# EasyEDA Pro project banzang电容_2023-06-19.epro, board POWER
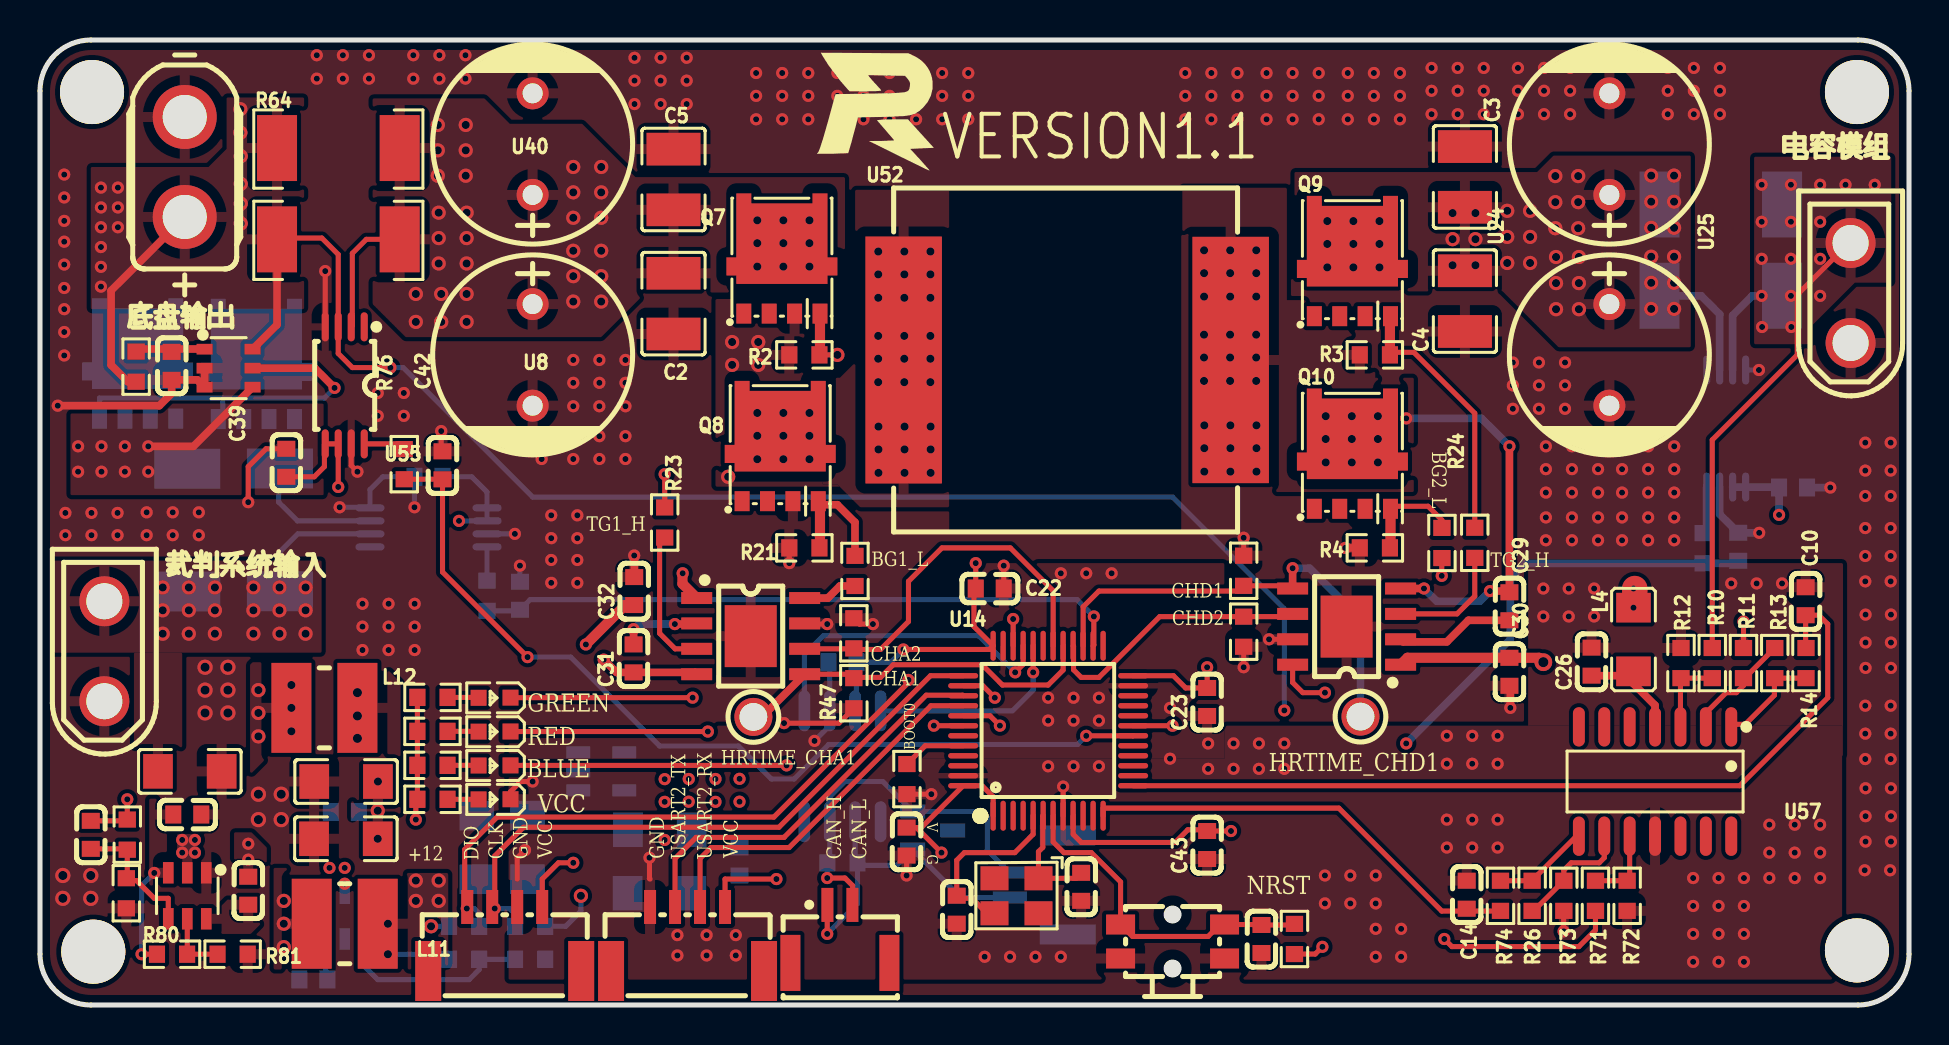
[diagram p2: board, top side]
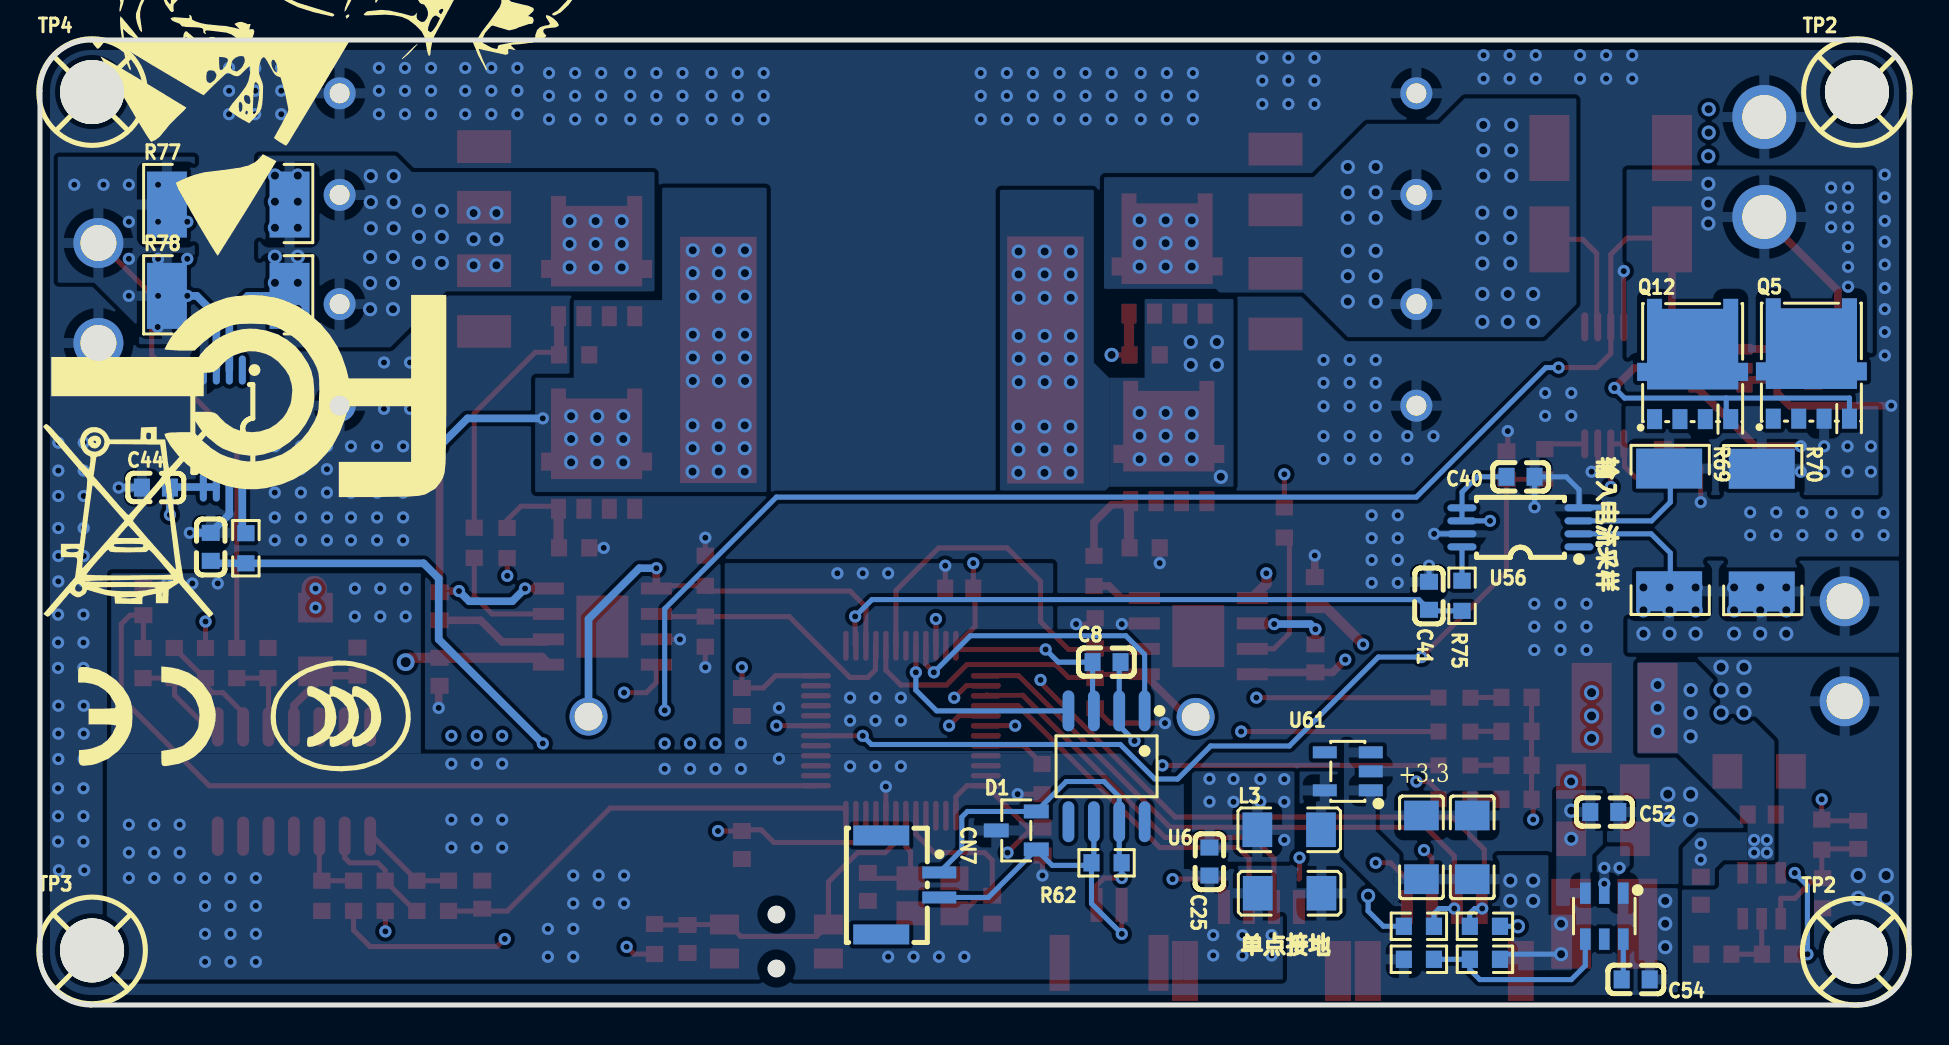
[diagram p3: board, bottom side, seen from below]

Outline 93.47 x 48.26 mm; copper layers: Top Layer, GND, VCC, Bottom Layer. Coordinates in mm from the lower left corner of the outline.
Outline path: 0,45.72 0,2.54 arc(0.74,0.74) 2.54,0 90.93,0 arc(92.73,0.74) 93.47,2.54 93.47,45.72 arc(92.73,47.52) 90.93,48.26 2.54,48.26 arc(0.74,47.52) 0,45.72
Stack: Top Layer 0.035mm / Dielectric1 0.48mm PP er 4.5 / GND 0.035mm / Dielectric2 0.48mm FR4 er 4.5 / VCC 0.035mm / Dielectric3 0.48mm PP er 4.5 / Bottom Layer 0.035mm

## Design rules (mm)
template: 自定义配置
spacing copperThickness1oz (default): track to track 0.102, other pairs 0.102 to 0.3
spacing copperThickness2oz: track to track 0.203, other pairs 0.152 to 0.3
track width copperThickness1oz (default): min 0.127, default 0.254, max 2.54
track width copperThickness2oz: min 0.203, default 0.254, max 2.54
differential pair differentialPair (default): width min 0.127, default 0.254, max 2.54; gap min 0.152, default 0.152
via viaSize (default): diameter min 0.5, default 0.61, max 10; hole min 0.3, default 0.305, max 6.299

## Placement (name value [footprint] x y rotation side)
C1  104/0603  [C0603]  6.59 31.96 270 top
C2  100uF  [C1210]  31.68 35.07 90 top
C3  100uF  [C1210]  71.26 41.41 270 top
C4  100uF  [C1210]  71.26 35.2 90 top
C5  100uF  [C1210]  31.68 41.28 270 top
C8  4.7uf  [C0603]  40.13 17.14 180 bottom
C10  10nf  [C0603]  88.3 20.19 90 top
C14  100nF  [C0603]  71.35 5.52 270 top
C18  100nF  [C0603]  61.09 3.3 90 top
C19  22pf  [C0603]  45.85 4.77 270 top
C20  22pf  [C0603]  52.07 5.91 270 top
C22  0.1uf  [C0603]  47.5 20.83 180 top
C23  0.1uf  [C0603]  58.37 15.16 90 top
C24  0.1uf  [C0603]  43.34 8.17 90 top
C25  0.1uf  [C0603]  34.99 7.17 90 bottom
C26  100nF  [C0603]  77.6 17.17 90 top
C29  104  [C0603]  73.49 19.94 270 top
C30  104  [C0603]  73.49 16.66 270 top
C31  104  [C0603]  29.69 17.33 90 top
C32  104  [C0603]  29.72 20.7 90 top
C39  100nF  [C0603]  12.32 27.12 270 top
C40  100nF  [C0603]  19.43 26.42 0 bottom
C41  10nf  [C0603]  24.01 20.47 90 bottom
C42  10nf  [C0603]  20.13 26.99 90 top
C43  0.1uf  [C0603]  58.37 8 90 top
C44  100nF  [C0603]  87.67 25.88 180 bottom
C45  10nf  [C0603]  84.93 22.91 90 bottom
C46  100nf  [C0603]  7.37 9.53 180 top
C47  10uF  [C1206]  7.49 11.68 180 top
C48  100nF  [C0603]  10.41 5.72 270 top
C49  10uF  [C1206]  15.31 11.18 180 top
C50  10uF  [C1206]  15.3 8.31 180 top
C51  NC  [C0603]  2.54 8.51 270 top
C52  100nf  [C0603]  15.24 9.65 0 bottom
C54  100nF  [C0603]  13.67 1.28 0 bottom
C55  10uF  [C1206]  24.38 7.88 90 bottom
C56  10uF  [C1206]  21.84 7.88 90 bottom
CN1  WAFER-GH1.25-2PWB  [CONN-TH_2P-P1.25_XUNPU_WAFER-GH1.25-2PWB]  40.01 3.56 0 top
CN2  A1257WR-S-4P  [CONN-SMD_A1257WR-S-4P]  32.39 3.3 0 top
CN3  A1257WR-S-4P  [CONN-SMD_A1257WR-S-4P]  23.24 3.3 0 top
CN4  XT30UPB-M  [CONN-TH_XT30UPB-M]  3.22 17.69 90 top
CN5  XT30UPB-F30.G.Y  [CONN-TH_XT30UPB-F]  7.24 41.91 90 top
CN6  XT30UPB-M  [CONN-TH_XT30UPB-M]  90.55 35.61 90 top
CN7  WAFER-GH1.25-2PWB  [CONN-TH_2P-P1.25_XUNPU_WAFER-GH1.25-2PWB]  49.95 6 270 bottom
D1  NUP2105L  [SOT-23-3_L2.9-W1.3-P1.90-LS2.4-BR]  44.65 8.73 180 bottom
L3  BLM31PG601SN1L  [L1206]  31 8.76 180 bottom
L4  10uH  [L1206]  79.69 18.28 90 top
L7  BLM31PG601SN1L  [L1206]  30.98 5.59 0 bottom
L11  22uH  [IND-SMD_L4.5-W4.0_CD43]  15.24 4.06 180 top
L12  22uH  [IND-SMD_L4.5-W4.0_CD43]  14.22 14.86 180 top
LED1  19-217/GHC-YR1S2/3T  [LED0603-RD]  22.73 10.29 180 top
LED2  19-217/GHC-YR1S2/3T  [LED0603-RD]  22.73 11.98 180 top
LED3  19-217/GHC-YR1S2/3T  [LED0603-RD]  22.73 13.67 180 top
LED4  19-217/GHC-YR1S2/3T  [LED0603-RD]  22.73 15.37 180 top
Q5  NMOS  [nmos qfn封装]  4.88 32.68 180 bottom
Q7  NMOS  [nmos qfn封装]  37.1 37.93 0 top
Q8  NMOS  [nmos qfn封装]  37.02 28.56 0 top
Q9  NMOS  [nmos qfn封装]  65.64 37.81 0 top
Q10  NMOS  [nmos qfn封装]  65.64 28.17 0 top
Q12  NMOS  [nmos qfn封装]  10.82 32.66 180 bottom
R1  47R/0603  [R0603]  4.81 31.92 90 top
R2  10K  [R0603]  38.23 32.51 0 top
R3  10K  [R0603]  66.76 32.51 0 top
R4  10K  [R0603]  66.76 22.86 0 top
R10  15K  [R0603]  83.63 17.1 270 top
R11  15K  [R0603]  85.19 17.1 270 top
R12  1K  [R0603]  82.07 17.1 270 top
R13  1K  [R0603]  86.76 17.1 270 top
R14  1K  [R0603]  88.32 17.1 90 top
R21  10K  [R0603]  38.23 22.86 0 top
R22  10Ω  [R0603]  40.76 21.71 270 top
R23  10Ω  [R0603]  31.24 24.13 270 top
R24  10Ω  [R0603]  71.76 23.11 90 top
R25  10Ω  [R0603]  70.11 23.11 90 top
R26  1K  [R0603]  74.62 5.46 90 top
R32  10K  [R0603]  62.74 3.3 270 top
R33  10K  [R0603]  43.36 11.3 90 top
R34  10K  [R0603]  19.63 10.29 0 top
R35  10K  [R0603]  19.63 11.99 0 top
R36  10K  [R0603]  19.63 13.69 0 top
R37  10K  [R0603]  19.63 15.38 0 top
R40  4.7K  [R0603]  24.51 3.94 0 bottom
R41  4.7K  [R0603]  21.21 3.94 180 bottom
R44  10K  [R0603]  60.2 21.72 270 top
R45  10K  [R0603]  60.2 18.67 90 top
R46  10K  [R0603]  40.7 18.59 270 top
R47  10K  [R0603]  40.7 15.59 90 top
R62  120Ω  [R0603]  40.13 7.11 180 bottom
R63  20mΩ  [RES-SMD_L6.4-W3.2-R2512]  14.92 38.29 180 top
R64  20mΩ  [RES-SMD_L6.4-W3.2-R2512]  14.92 42.86 180 top
R69  10mΩ  [RES-SMD_L6.4-W3.2-R2512]  12 23.76 270 bottom
R70  10mΩ  [RES-SMD_L6.4-W3.2-R2512]  7.37 23.75 270 bottom
R71  15K  [R0603]  77.79 5.46 90 top
R72  1K  [R0603]  79.38 5.46 90 top
R73  15K  [R0603]  76.21 5.46 90 top
R74  1K  [R0603]  73.04 5.46 270 top
R75  1K  [R0603]  22.36 20.47 270 bottom
R76  1K  [R0603]  18.22 27.05 270 top
R77  20mΩ  [RES-SMD_L6.4-W3.2-R2512]  84.06 40.03 180 bottom
R78  20mΩ  [RES-SMD_L6.4-W3.2-R2512]  84.06 35.46 180 bottom
R79  1K  [R0603]  83.18 22.84 270 bottom
R80  100K  [R0603]  6.6 2.54 180 top
R81  NC  [R0603]  9.63 2.54 180 top
R82  100K  [R0603]  4.37 8.52 270 top
R83  100K  [R0603]  4.32 5.59 270 top
R86  100K  [R0603]  21.21 2.29 0 bottom
R87  100K  [R0603]  24.51 2.29 0 bottom
SW2  PTCF-Q-T/R  [SW-SMD_4P-L4.7-W3.5-P1.70-LS5.9]  56.64 3.17 0 top
TP2  -  [M3螺丝]  2.6 2.6 180 bottom
TP2#2  -  [M3螺丝]  2.54 45.59 180 bottom
TP3  -  [M3螺丝]  90.8 2.67 180 bottom
TP4  -  [M3螺丝]  90.8 45.59 180 bottom
U6  SN65HVD232DRG4  [SOIC-8_L4.9-W3.9-P1.27-LS6.0-BL]  40.13 11.94 0 bottom
U7  LM5050MK-1/NOPB  [TSOT-23-6_L2.9-W1.6-P0.95-LS2.8-BR]  9.43 31.85 180 top
U8  470uF  [CAP-TH_BD10.0-P5.00-D1.0-FD]  24.64 32.51 270 top
U10  UCC27211AQDDARQ1  [SOPOWERPAD-8_L4.9-W3.9-P1.27-LS6.0-BL-EP]  65.35 18.92 90 top
U11  UCC27211AQDDARQ1  [SOPOWERPAD-8_L4.9-W3.9-P1.27-LS6.0-BL-EP]  35.54 18.45 270 top
U14  STM32F334C8T6TR  [LQFP-48_L7.0-W7.0-P0.50-LS9.0-BL]  50.42 13.72 0 top
U24  470uF  [CAP-TH_BD10.0-P5.00-D1.0-FD]  78.49 43.05 90 top
U25  470uF  [CAP-TH_BD10.0-P5.00-D1.0-FD]  78.49 32.51 270 top
U40  470uF  [CAP-TH_BD10.0-P5.00-D1.0-FD]  24.64 43.05 90 top
U52  47uH  [IND-SMD_L17.2-W17.2]  51.37 32.26 0 top
U53  5003  [TEST-TH_BD2.54-P1.39]  35.68 14.41 0 top
U54  5003  [TEST-TH_BD2.54-P1.39]  66.04 14.42 0 top
U55  INA240A2PWR  [TSSOP-8_L4.4-W3.0-P0.65-LS6.4-BL]  15.24 30.99 180 top
U56  INA240A2PWR  [TSSOP-8_L4.4-W3.0-P0.65-LS6.4-BL]  19.43 23.89 90 bottom
U57  LM324  [SOP-14_L8.6-W3.9-P1.27-LS6.0-BL]  80.77 11.18 180 top
U58  INA240A2PWR  [TSSOP-8_L4.4-W3.0-P0.65-LS6.4-BL]  84.33 28.83 0 bottom
U59  TPS54202DDCR  [SOT-23-6_L2.9-W1.6-P0.95-LS2.8-BL]  7.37 5.46 180 top
U60  TPS54202DDCR  [SOT-23-6_L2.9-W1.6-P0.95-LS2.8-BL]  15.24 4.45 0 bottom
U61  TPS76333DBVR-TP  [SOT-23-5_L3.0-W1.6-P0.95-LS2.8-BR]  28.07 11.68 180 bottom
X1  8Mhz  [OSC-SMD_4P-L3.2-W2.5-BL]  48.83 5.46 180 top

## Footprints (pads in the part's own frame, mm; a bottom-side part is the same pattern mirrored in y, then rotated)
C0603
  rect 0.8x0.9 smd: 1(-0.7,0) 2(0.7,0)
C1206
  rect 1.485x1.728 smd: 1(-1.593,0) 2(1.593,0)
C1210
  rect 1.635x2.7 smd: 1(-1.518,0) 2(1.518,0)
CAP-TH_BD10.0-P5.00-D1.0-FD
  round 1.6 hole 1: 1(-2.54,0) 2(2.54,0)
CONN-SMD_A1257WR-S-4P
  rect 0.6x1.7 smd: 1(1.875,1.6) 2(0.625,1.6) 3(-0.625,1.6) 4(-1.875,1.6)
  rect 1.3x3 smd: 5(3.825,-1.6) 6(-3.825,-1.6)
CONN-TH_2P-P1.25_XUNPU_WAFER-GH1.25-2PWB
  rect 0.6x1.7 smd: 1(-0.625,1.45) 2(0.625,1.45)
  rect 1x2.8 smd: 3(-2.475,-1.45) 4(2.475,-1.45)
CONN-TH_XT30UPB-F
  round 3.2 hole 2.2: 1(-2.5,0) 2(2.5,0)
CONN-TH_XT30UPB-M
  round 2.5 hole 1.8: 1(-2.5,0) 2(2.5,0)
IND-SMD_L4.5-W4.0_CD43
  rect 2x4.5 smd: 1(-1.65,0) 2(1.65,0)
IND-SMD_L17.2-W17.2
  rect 3.825x12.35 smd: 1(-8.178,0)
  rect 3.825x12.32 smd: 2(8.178,0)
L1206
  rect 1.485x1.728 smd: 1(-1.593,0) 2(1.593,0)
LED0603-RD
  rect 0.8x0.8 smd: 1(-0.799,-0.004) 2(0.799,0.004)
LQFP-48_L7.0-W7.0-P0.50-LS9.0-BL
  oval 0.27x1.5 smd: 1(-2.75,-4.25) 2(-2.25,-4.25) 3(-1.75,-4.25) 4(-1.25,-4.25) 5(-0.75,-4.25) 6(-0.25,-4.25) 7(0.25,-4.25) 8(0.75,-4.25) 9(1.25,-4.25) 10(1.75,-4.25) 11(2.25,-4.25) 12(2.75,-4.25) 25(2.75,4.25) 26(2.25,4.25) 27(1.75,4.25) 28(1.25,4.25) 29(0.75,4.25) 30(0.25,4.25) 31(-0.25,4.25) 32(-0.75,4.25) 33(-1.25,4.25) 34(-1.75,4.25) 35(-2.25,4.25) 36(-2.75,4.25)
  oval 1.5x0.27 smd: 13(4.25,-2.75) 14(4.25,-2.25) 15(4.25,-1.75) 16(4.25,-1.25) 17(4.25,-0.75) 18(4.25,-0.25) 19(4.25,0.25) 20(4.25,0.75) 21(4.25,1.25) 22(4.25,1.75) 23(4.25,2.25) 24(4.25,2.75) 37(-4.25,2.75) 38(-4.25,2.25) 39(-4.25,1.75) 40(-4.25,1.25) 41(-4.25,0.75) 42(-4.25,0.25) 43(-4.25,-0.25) 44(-4.25,-0.75) 45(-4.25,-1.25) 46(-4.25,-1.75) 47(-4.25,-2.25) 48(-4.25,-2.75)
M3螺丝
  round 3.2 hole 3.2: 1(-0.064,0.064)
nmos qfn封装
  rect 0.75x1 smd: 1(1.905,-3.358) 3(-1.905,-3.358) 3(-0.635,-3.358) 3(0.635,-3.358)
  custom 5.55x4.53 smd: 2(0,0.392)
OSC-SMD_4P-L3.2-W2.5-BL
  rect 1.4x1.2 smd: 1(-1.1,-0.875) 2(1.1,-0.875) 3(1.1,0.875) 4(-1.1,0.875)
R0603
  rect 0.806x0.864 smd: 1(-0.753,0) 2(0.753,0)
RES-SMD_L6.4-W3.2-R2512
  rect 2x3.3 smd: 1(-3.067,0) 2(3.067,0)
SOIC-8_L4.9-W3.9-P1.27-LS6.0-BL
  oval 0.588x2.045 smd: 1(-1.905,-2.772) 2(-0.635,-2.772) 3(0.635,-2.772) 4(1.905,-2.772) 5(1.905,2.772) 6(0.635,2.772) 7(-0.635,2.772) 8(-1.905,2.772)
SOP-14_L8.6-W3.9-P1.27-LS6.0-BL
  oval 0.595x1.968 smd: 1(-3.81,-2.734) 2(-2.54,-2.734) 3(-1.27,-2.734) 4(0,-2.734) 5(1.27,-2.734) 6(2.54,-2.734) 7(3.81,-2.734) 8(3.81,2.734) 9(2.54,2.734) 10(1.27,2.734) 11(0,2.734) 12(-1.27,2.734) 13(-2.54,2.734) 14(-3.81,2.734)
SOPOWERPAD-8_L4.9-W3.9-P1.27-LS6.0-BL-EP
  rect 0.6x1.55 smd: 1(-1.905,-2.7) 2(-0.635,-2.7) 3(0.635,-2.7) 4(1.905,-2.7) 5(1.905,2.7) 6(0.635,2.7) 7(-0.635,2.7) 8(-1.905,2.7)
  rect 3.1x2.6 smd: 9(0,0)
SOT-23-3_L2.9-W1.3-P1.90-LS2.4-BR
  rect 1.25x0.7 smd: 1(1,-0.95) 2(1,0.95) 3(-1,0)
SOT-23-5_L3.0-W1.6-P0.95-LS2.8-BR
  rect 1.2x0.6 smd: 1(1.15,-0.95) 2(1.15,0) 3(1.15,0.95) 4(-1.15,0.95) 5(-1.15,-0.95)
SOT-23-6_L2.9-W1.6-P0.95-LS2.8-BL
  rect 0.532x1.072 smd: 1(-0.95,-1.149) 2(0,-1.149) 3(0.95,-1.149) 4(0.95,1.149) 5(0,1.149) 6(-0.95,1.149)
SW-SMD_4P-L4.7-W3.5-P1.70-LS5.9
  rect 1.45x1 smd: 1(-2.6,0.85) 2(2.6,0.85) 3(-2.6,-0.85) 4(2.6,-0.85)
TEST-TH_BD2.54-P1.39
  round 1.9 hole 1.39: 1(0,0)
TSOT-23-6_L2.9-W1.6-P0.95-LS2.8-BR
  rect 0.8x0.532 smd: 1(1.2,-0.95) 2(1.2,0) 3(1.2,0.95) 4(-1.2,0.95) 5(-1.2,0) 6(-1.2,-0.95)
TSSOP-8_L4.4-W3.0-P0.65-LS6.4-BL
  oval 0.353x1.454 smd: 1(-0.975,-2.927) 2(-0.325,-2.927) 3(0.325,-2.927) 4(0.975,-2.927) 5(0.975,2.927) 6(0.325,2.927) 7(-0.325,2.927) 8(-0.975,2.927)

## Nets
As in the schematic, except:
+3.3V: L3.2 U61.5
VCC: C8.1 C22.2 C23.2 C24.2 C25.2 C39.2 C40.2 C43.2 C44.2 CN2.1 CN3.1 L3.1 L4.2 R32.2 R34.1 R35.1 R36.1 R37.1 R40.2 R41.2 U6.3 U14.1 U14.9 U14.24 U14.36 U14.48 U55.5 U55.6 U56.5 U56.6 U58.5 U58.6

Pads without a net: CN1 3 4; CN2 5 6; CN3 5 6; CN7 3 4; TP2 1; TP2#2 1; TP3 1; TP4 1; U6 5 8; U14 2 3 4 10 11 14 15 16 17 20 21 22 25 31 43; U55 1; U56 1; U57 5 6 7 12 13 14; U58 1; U60 5; U61 4; X1 2 4

## Via types
v1: diameter 0.61, hole 0.305, Top Layer to Bottom Layer, 453 vias
v2: diameter 0.762, hole 0.457, Top Layer to Bottom Layer, 17 vias
v3: diameter 0.711, hole 0.406, Top Layer to Bottom Layer, 206 vias
v4: diameter 0.889, hole 0.508, Top Layer to Bottom Layer, 1 via

## Routing (per net, layer and track width the routed paths; a pad name or vN(x,y) marks a point on that pad's centre or on a via; arc(x,y) is an arc through that point)
+3.3VO: length 3.2
  Bottom Layer w0.254: v3(17.4,2.54) 20.2,2.54 R86.1
  vias: v3(17.4,4.06) v3(18.8,6.22) v3(18.8,5.21) v3(19.94,6.22) v3(19.94,5.21)
+12V: length 96.4
  Top Layer w0.254: C51.1 4.3,9.21 R82.1 v1(4.37,10.29)
  Top Layer w0.508: v4(75.18,17.14) 74.96,17.36 68.39,17.36 68.05,17.02 ; 27.3,18.03 29.27,20 C32.1 ; U11.1 32.13,21.06 32.13,21.59
  GND w0.254: v1(4.37,10.29) 5.64,11.56 13.65,11.56 v3(16.89,8.31)
  VCC w1.016: 15.88,15.75 v2(15.88,14.46) v2(15.88,13.33) 22.61,13.33 v1(27.3,18.03) 30.86,21.59 v1(32.14,21.59) 33.27,21.59 34.29,20.57 67.44,20.57 70.87,17.14 v4(75.18,17.14)
  vias: v2(15.88,15.62) v3(16.9,11.18) v3(16.89,9.72)
AGND: length 24
  Top Layer w0.254: C22.1 v1(48.2,21.97) ; 23.87,6.3 23.87,7.36 v1(24.26,7.75) ; 30.51,6.3 30.48,6.33 v1(30.48,7.37) ; v1(24.64,11.18) 24.04,11.18 23.53,10.67 LED1.1 ; C24.1 v1(43.34,6.48) ; U14.8 v1(51.17,10.92) ; R33.1 v1(44.58,10.54)
  GND w0.254: v1(44.58,10.54) 41.4,10.54 v1(38.73,13.21) ; v1(24.64,11.18) 24.64,8.13 v1(24.26,7.75)
  Bottom Layer w0.254: C8.2 39.5,17.08 U6.2 39.5,13.97 v1(38.73,13.21)
  vias: v1(31.88,3.5) v1(31.88,2.48) v1(33.34,3.5) v1(33.34,2.48) v1(34.8,3.5) v1(34.8,2.48) v1(47.24,2.41) v1(48.51,2.41) v1(49.78,2.41) v1(50.42,15.37) v1(50.42,14.22) v1(50.42,11.94) v1(51.05,21.59) v1(51.05,2.41) v1(51.69,15.37) v1(51.69,14.22) v1(51.69,11.94) v1(52.32,21.59) v1(52.96,15.37) v1(52.96,14.22) v1(52.96,11.94) v1(53.59,21.59) v1(56.52,14.86) v1(56.52,12.32) v1(58.42,13.08) v1(58.42,11.81) v1(59.69,13.08) v1(59.69,11.81) v1(60.96,13.08) v1(60.96,11.81) v1(62.23,13.08) v1(62.23,11.81) v1(64.26,6.48) v1(64.26,5.08) v1(65.53,6.48) v1(65.53,5.08) v1(66.8,6.48) v1(66.8,5.08) v1(66.8,3.81) v1(66.8,2.41) v1(68.07,3.81) v1(68.07,2.41) v1(70.36,13.46) v1(70.36,12.06) v1(70.36,9.27) v1(70.36,7.87) v1(71.63,13.46) v1(71.63,12.06) v1(71.63,9.27) v1(71.63,7.87) v1(72.9,13.46) v1(72.9,12.06) v1(72.9,9.27) v1(72.9,7.87) v1(75.18,20.83) v1(75.18,19.43) v1(76.45,20.83) v1(76.45,19.43) v1(77.72,20.83) v1(77.72,19.43) v1(82.68,6.35) v1(82.68,4.95) v1(82.68,3.56) v1(82.68,2.16) v1(83.95,6.35) v1(83.95,4.95) v1(83.95,3.56) v1(83.95,2.16) v1(84.58,21.08) v1(85.22,6.35) v1(85.22,4.95) v1(85.22,3.56) v1(85.22,2.16) v1(85.85,21.08) v1(86.49,9.02) v1(86.49,7.62) v1(86.49,6.35) v1(87.12,21.08) v1(87.76,9.02) v1(87.76,7.62) v1(87.76,6.35) v1(89.03,9.02) v1(89.03,7.62) v1(89.03,6.35)
GND: length 48.1
  Top Layer w0.254: R45.1 v1(60.2,16.89) ; R46.1 40.99,19.05 v1(41.66,19.05) ; v1(60.2,23.37) R44.1 ; R73.1 76.2,4.7 v1(76.2,3.68) ; R47.1 39.96,14.1 v1(37.21,14.1) ; v1(39.37,19.05) 38.28,19.05 U11.7 ; C39.1 11.31,27.82 10.41,26.92 v1(10.41,25.15) ; 62.64,18.29 v1(61.47,18.29) ; R21.1 v1(37.47,22.1) ; R11.1 v1(85.19,19.18) ; C42.2 20.07,27.75 v1(20.07,28.7) ; v1(15.88,26.67) 15.56,26.98 U55.7 ; U55.4 v1(14.27,36.7)
  Top Layer w0.381: C30.2 73.53,15.92 v1(73.53,14.86) ; 66.01,22.86 v1(65.28,22.86) ; v1(0.89,29.97) 5.97,29.97 6.59,30.59 C1.2 7.87,31.26 U7.3 U7.2 ; C32.2 v1(29.72,22.48)
  Bottom Layer w0.254: v1(85.97,31.76) U58.4 ; C41.2 24,21.17 v1(24,21.97) ; v1(14.99,24.89) 16.47,24.89 U56.4 16.5,25.78 17.15,26.42 C40.1 v1(18.73,24.89) ; U56.7 v1(23.75,23.56)
  Bottom Layer w0.381: 88.37,25.88 v1(89.54,25.88) ; 84,25.9 84,24.54 C45.2 v1(85.98,23.61)
  vias: v1(1.21,41.53) v1(1.21,40.39) v1(1.21,39.21) v1(1.21,38.17) v1(1.21,37.03) v1(1.21,35.86) v1(1.21,34.8) v1(1.21,33.66) v1(1.21,32.48) v1(1.27,24.61) v1(1.27,23.5) v1(2.57,24.61) v1(2.57,23.5) v1(3.88,24.61) v1(3.88,23.5) v1(5.33,24.64) v1(5.33,23.5) v1(6.64,24.64) v1(6.64,23.5) v1(7.94,24.64) v1(7.94,23.5) v1(13.84,47.5) v1(13.84,46.33) v1(15.15,47.5) v1(15.15,46.33) v1(16.13,20.07) v1(16.13,18.92) v1(16.13,17.75) v1(16.45,47.5) v1(16.45,46.33) v1(16.89,30.61) v1(16.89,29.46) v1(17.43,20.07) v1(17.43,18.92) v1(17.43,17.75) v1(18.2,30.61) v1(18.2,29.46) v1(18.67,47.5) v1(18.67,46.33) v1(18.74,20.07) v1(18.74,18.92) v1(18.74,17.75) v1(19.97,47.5) v1(19.97,46.33) v1(21.28,47.5) v1(21.28,46.33) v1(23.78,28.45) v1(25.09,28.45) v1(25.09,27.31) v1(25.57,24.49) v1(25.57,23.35) v1(25.57,22.25) v1(25.57,21.11) v1(26.67,32.26) v1(26.67,31.11) v1(26.67,29.94) v1(26.67,28.45) v1(26.67,27.31) v1(26.87,24.49) v1(26.87,23.35) v1(26.87,22.25) v1(26.87,21.11) v1(27.97,32.26) v1(27.97,31.11) v1(27.97,29.94) v1(27.97,28.45) v1(27.97,27.31) v1(29.28,32.26) v1(29.28,31.11) v1(29.28,29.94) v1(29.28,28.45) v1(29.28,27.31) v1(29.73,47.37) v1(29.73,46.23) v1(29.73,45.06) v1(31.04,47.37) v1(31.04,46.23) v1(31.04,45.06) v1(32.34,47.37) v1(32.34,46.23) v1(32.34,45.06) v1(35.81,46.61) v1(35.81,45.47) v1(35.81,44.29) v1(37.12,46.61) v1(37.12,45.47) v1(37.12,44.29) v1(38.42,46.61) v1(38.42,45.47) v1(38.42,44.29) v1(39.88,46.61) v1(39.88,45.47) v1(39.88,44.29) v1(41.18,46.61) v1(41.18,45.47) v1(41.18,44.29) v1(42.49,46.61) v1(42.49,45.47) v1(42.49,44.29) v1(43.82,46.61) v1(43.82,45.47) v1(43.82,44.29) v1(45.12,46.61) v1(45.12,45.47) v1(45.12,44.29) v1(46.42,46.61) v1(46.42,45.47) v1(46.42,44.29) v1(57.28,46.61) v1(57.28,45.47) v1(57.28,44.29) v1(58.58,46.61) v1(58.58,45.47) v1(58.58,44.29) v1(59.89,46.61) v1(59.89,45.47) v1(59.89,44.29) v1(61.34,46.61) v1(61.34,45.47) v1(61.34,44.29) v1(62.65,46.61) v1(62.65,45.47) v1(62.65,44.29) v1(63.95,46.61) v1(63.95,45.47) v1(63.95,44.29) v1(65.41,46.61) v1(65.41,45.47) v1(65.41,44.29) v1(66.71,46.61) v1(66.71,45.47) v1(66.71,44.29) v1(68.01,46.61) v1(68.01,45.47) v1(68.01,44.29) v1(69.6,46.86) v1(69.6,45.72) v1(69.6,44.55) v1(70.9,46.86) v1(70.9,45.72) v1(70.9,44.55) v1(72.2,46.86) v1(72.2,45.72) v1(72.2,44.55) v1(73.66,32.13) v1(73.66,30.99) v1(73.66,29.82) v1(73.91,46.86) v1(73.91,45.72) v1(73.91,44.55) v1(74.96,32.13) v1(74.96,30.99) v1(74.96,29.82) v1(75.22,46.86) v1(75.22,45.72) v1(75.22,44.55) v1(75.31,27.94) v1(75.31,26.8) v1(75.31,25.63) v1(75.31,24.38) v1(75.31,23.24) v1(76.27,32.13) v1(76.27,30.99) v1(76.27,29.82) v1(76.52,46.86) v1(76.52,45.72) v1(76.52,44.55) v1(76.62,27.94) v1(76.62,26.8) v1(76.62,25.63) v1(76.62,24.38) v1(76.62,23.24) v1(77.92,27.94) v1(77.92,26.8) v1(77.92,25.63) v1(77.92,24.38) v1(77.92,23.24) v1(79.12,27.94) v1(79.12,26.8) v1(79.12,25.63) v1(79.12,24.38) v1(79.12,23.24) v1(80.43,27.94) v1(80.43,26.8) v1(80.43,25.63) v1(80.43,24.38) v1(80.43,23.24) v1(81.41,46.86) v1(81.41,45.72) v1(81.41,44.55) v1(81.73,27.94) v1(81.73,26.8) v1(81.73,25.63) v1(81.73,24.38) v1(81.73,23.24) v1(82.71,46.86) v1(82.71,45.72) v1(82.71,44.55) v1(84.02,46.86) v1(84.02,45.72) v1(84.02,44.55) v1(91.29,28.12) v1(91.29,26.73) v1(91.29,25.46) v1(91.29,23.85) v1(91.29,22.45) v1(91.29,21.19) v1(91.3,19.52) v1(91.3,18.13) v1(91.3,16.86) v1(91.29,14.97) v1(91.29,13.57) v1(91.29,12.3) v1(91.3,10.84) v1(91.3,9.44) v1(91.3,8.17) v1(91.26,6.74) v1(92.53,6.74) v1(92.55,28.12) v1(92.55,26.73) v1(92.55,25.46) v1(92.55,23.85) v1(92.55,22.45) v1(92.55,21.19) v1(92.57,19.52) v1(92.57,18.13) v1(92.57,16.86) v1(92.55,14.97) v1(92.55,13.57) v1(92.55,12.3) v1(92.57,10.84) v1(92.57,9.44) v1(92.57,8.17) v2(1.14,6.48) v2(1.14,5.33) v2(2.54,6.48) v2(2.54,5.33) v2(8.26,16.89) v2(8.26,15.75) v2(8.26,14.61) v2(9.4,16.89) v2(9.4,15.75) v2(9.4,14.61) v2(10.92,10.54) v2(10.92,9.27) v2(12.06,10.54) v2(12.06,9.27)
VBAT+: length 12
  Top Layer w0.254: v1(5.08,2.54) R80.2
  Bottom Layer w0.254: R69.2 11.94,20.75 11.94,22.61 12.89,23.56 U56.2 ; v1(5.08,2.54) 5.08,5.97 v1(5.72,6.6)
  vias: v3(6.14,20.88) v3(6.14,19.74) v3(6.14,18.57) v3(7.44,20.88) v3(7.44,19.74) v3(7.44,18.57) v3(8.75,20.88) v3(8.75,19.74) v3(8.75,18.57) v3(10.67,20.88) v3(10.67,19.74) v3(10.67,18.57) v3(11.98,20.88) v3(11.98,19.74) v3(11.98,18.57) v3(13.28,20.88) v3(13.28,19.74) v3(13.28,18.57)
VBAT+T: length 13.1
  Top Layer w0.381: v1(5.42,27.94) 7.67,27.94 U7.4
  Bottom Layer w0.254: U56.3 12.87,24.21 11.94,25.15 11.94,26.77 12,26.83
  vias: v1(1.91,27.94) v1(1.91,26.67) v1(3.08,27.94) v1(3.08,26.67) v1(4.25,27.94) v1(4.25,26.67) v1(5.42,26.67)
VCC: length 80.2
  Top Layer w0.254: U14.9 51.67,8.54 52.08,8.13 56.77,8.13 57.4,8.76 58.31,8.76 C43.2 v1(59.56,8.7) ; v1(43.18,17.78) 47.48,17.78 U14.36 46.71,18.93 46.71,20.74 C22.2 v1(46.8,22.1) ; R37.1 R36.1 R35.1 R34.1 18.8,10.21 v1(18.8,9.27) ; U14.24 56.69,16.47 57.3,15.86 C23.2 v1(58.37,16.89) ; CN3.1 25.12,6.3 25.93,7.11 v1(26.67,7.11) ; 43.83,8.87 44.08,8.87 U14.48 47.12,10.97 47.67,10.41 U14.1 ; 43.83,8.87 C24.2 ; 43.83,8.87 v1(45.08,7.62) ; R32.2 63.77,2.55 v1(64.14,2.91) ; CN2.1 34.26,6.3 v1(36.83,6.3) ; 12.38,26.42 13.72,26.42 14.22,26.92 14.22,28.02 U55.5 U55.6 v1(14.92,25.91)
  Top Layer w1.27: 79.76,20.83 79.76,19.94 v1(79.69,19.87)
  VCC w0.381: v1(79.69,20.83) 81.92,20.83 85.6,24.51 v1(86.97,24.51)
  Bottom Layer w0.254: v3(19.56,3.94) R41.2 ; C40.2 21.59,26.42 22.35,25.65 22.35,24.87 U56.5 U56.6 v1(20.95,24.21) ; v3(27.05,5.46) 27.05,4.7 26.29,3.94 R40.2 ; U6.3 40.83,14.78 C8.1 42.55,17.14 v1(43.18,17.78)
  Bottom Layer w0.381: 84.65,25.9 86.95,25.9 C44.2 v1(86.97,24.51)
  vias: v1(31.24,11.3) v1(31.24,10.16) v1(31.24,8.25) v1(32.44,11.3) v1(32.44,10.17) v1(33.78,11.3) v1(33.78,10.16) v1(34.98,11.31) v1(34.98,10.17)
VIN+: length 106.4
  Top Layer w0.254: v1(17.53,31.88) 15.62,31.88 14.92,32.58 U55.3 14.92,37.54 14.1,38.35 11.92,38.35 R63.2 ; v1(70.23,3.3) 70.61,2.92 76.96,2.92 77.79,3.75 R71.1
  Top Layer w0.381: R63.2 11.86,34.02 U7.6 ; R1.1 4.39,31.17 3.56,32 3.56,35.73 CN5.1
  VCC w0.254: v1(70.23,3.3) 68.07,5.46 68.07,8.89 v1(62.23,14.73)
  Bottom Layer w0.254: v1(62.23,14.73) 62.23,19.81 56.64,25.4 24.64,25.4 18.16,31.88 v1(17.53,31.88)
  vias: v1(3.05,40.88) v1(3.05,39.89) v1(3.05,38.9) v1(3.05,37.91) v1(3.05,36.92) v1(3.05,35.92) v1(3.9,40.88) v1(3.9,39.89) v1(3.9,38.9) v3(10.02,44.8) v3(10.02,43.63) v3(10.04,42.45) v3(10.04,41.07) v3(10.04,40.08) v3(10.04,39.08)
VIN+T: length 6.4
  Top Layer w0.254: 17.99,38.29 16.32,38.29 15.62,37.59 15.62,33.97 U55.2
  vias: v3(18.8,35.56) v3(18.8,34.16) v3(19.89,44.01) v3(19.89,42.74) v3(19.89,41.47) v3(19.94,39.62) v3(19.94,38.35) v3(19.94,37.08) v3(20.07,35.56) v3(20.07,34.16) v3(21.29,44.01) v3(21.29,42.74) v3(21.29,41.47) v3(21.34,39.62) v3(21.34,38.35) v3(21.34,37.08) v3(21.34,35.56) v3(21.34,34.16) v3(26.67,41.91) v3(26.67,40.64) v3(26.67,39.37) v3(26.67,37.72) v3(26.67,36.45) v3(26.67,35.18) v3(28.07,41.91) v3(28.07,40.64) v3(28.07,39.37) v3(28.07,37.72) v3(28.07,36.45) v3(28.07,35.18) v3(35.87,39.24) v3(35.87,38.1) v3(35.87,36.93) v3(37.18,39.24) v3(37.18,38.1) v3(37.18,36.93) v3(38.48,39.24) v3(38.48,38.1) v3(38.48,36.93)
ADC1_IN3_VBAT_DEC(PA2): length 22.4
  Top Layer w0.254: U14.12 53.17,9.85 64.96,9.85 70.1,4.7 73.03,4.7 R74.2
ADC1_IN4_VCAP_DEC(PA3): length 43.2
  Top Layer w0.254: R14.2 88.3,17.87 C10.1 88.96,19.49 89.41,19.05 89.41,15.37 85.01,10.97 U14.13
ADC1_IN11_IBAT_DEC(PB0): length 46.3
  Top Layer w0.254: v1(52.32,13.46) 54.67,13.46 U14.18 ; v1(24.38,17.4) 20.13,21.65 C42.1 20.13,26.29 R76.2
  Bottom Layer w0.254: v1(52.32,13.46) 51.89,13.03 39.45,13.03 37.72,11.3 36.58,11.3 34.92,12.95 30.99,12.95 26.54,17.4 v1(24.38,17.4)
ADC1_IN12_ICAPOUT_DEC(PB1): length 36.2
  Top Layer w0.254: U14.19 v1(56.64,13.97)
  GND w0.254: v1(68.33,13.08) 63.75,13.08 62.86,13.97 56.65,13.97 v1(56.64,13.97)
  Bottom Layer w0.381: C45.1 84.81,22.09 R79.2 74.29,22.09 73.53,21.34 73.53,18.29 v1(68.33,13.08)
ADC1_IN13_ICAP_DEC(PB13): length 32.4
  Top Layer w0.254: v1(52.7,19.43) 52.7,18 U14.26
  Bottom Layer w0.254: v1(52.7,19.43) 51.86,20.27 24.51,20.27 C41.1 23.95,19.71 R75.2
BG1_L: length 2.8
  Top Layer w0.381: R22.2 40.01,20.95 39.4,20.35 U11.8
BG2_L: length 12.7
  Top Layer w0.254: v1(70.1,21.46) 70.1,22.34 R25.1 ; v1(64.26,15.62) 63.16,15.62 62.65,16.13 U10.8
  GND w0.254: v1(70.1,21.46) 70.1,20.07 68.71,18.67 67.44,18.67 64.39,15.62 v1(64.26,15.62)
BLUE(PB6): length 23.5
  Top Layer w0.254: v1(44.7,13.97) 44.71,13.97 U14.42 ; 23.53,11.98 v1(37.34,11.98)
  VCC w0.254: v1(44.7,13.97) 42.72,11.98 v1(37.34,11.98)
CAN1_H: length 18.7
  Top Layer w0.254: v1(39.37,6.35) 40.26,6.35 40.64,5.97 40.64,5.02 CN1.2
  Bottom Layer w0.254: CN7.1 47.37,7.76 47.37,9.4 47.09,9.68 D1.2 42.15,11.18 40.26,11.18 39.5,10.41 U6.7 39.5,7.23 R62.2 39.37,7.1 v1(39.37,6.35)
CAN1_L: length 17
  Top Layer w0.254: v1(39.37,3.56) 39.37,5 CN1.1
  Bottom Layer w0.254: 40.89,6.98 40.89,5.07 v1(39.37,3.56) ; 40.89,6.98 40.76,6.98 R62.1 ; 40.89,6.98 42.85,6.98 D1.1 46.05,5.38 CN7.2 ; 40.89,6.98 R62.1 ; U6.6 40.77,7.23 R62.1
CAN1_RX(PA11): length 10.3
  Top Layer w0.254: U14.32 v1(49.67,16.64)
  Bottom Layer w0.254: U6.4 48.63,14.71 49.67,15.75 v1(49.67,16.64)
CAN1_TX(PA12): length 16
  Top Layer w0.254: U14.33 49.17,17.04 v1(48.77,16.64)
  Bottom Layer w0.254: U6.1 38.23,17.53 39.17,18.47 46.94,18.47 v1(48.77,16.64)
EN0: length 3.3
  Top Layer w0.254: R81.2 R80.1 7.37,2.55 U59.5
FB0: length 6.9
  Top Layer w0.254: 4.33,6.22 4.37,6.26 R82.2 4.32,7.81 C51.2 ; 4.33,6.22 4.32,6.21 ; 4.33,6.22 4.83,6.22 5.72,5.33 6.42,5.33 U59.4
FB1: length 9.9
  Bottom Layer w0.254: U60.4 16.19,1.97 16.89,1.27 21.46,1.27 21.96,1.77 R86.2 R87.1
GREEN(PA15): length 28.1
  Top Layer w0.254: U14.38 47.15,15.97 v1(47.75,15.37) ; LED4.1 v1(32.64,15.37)
  VCC w0.254: v1(32.64,15.37) 34.44,17.17 46.84,17.17 47.75,16.26 v1(47.75,15.37)
HRTIME_CHA1(PA8): length 18.8
  Top Layer w0.254: U14.29 51.17,16.75 50.42,16 48.13,16 47.12,17.02 42.67,17.02 42.04,16.38 40.74,16.38 R47.2 40.5,16.54 U11.5
  Top Layer w0.381: U11.5 35.73,14.03 35.68,14.03
HRTIME_CHA2(PA9): length 19.4
  Top Layer w0.254: U11.6 40.68,17.81 R46.2 40.76,17.78 42.04,17.78 43.43,19.18 43.43,21.19 45.11,22.86 48.53,22.86 50.67,20.72 U14.30
HRTIME_CHD1(PB14): length 23.3
  Top Layer w0.254: U14.27 52.17,19.91 52.96,20.7 59.94,20.7 R44.2 62.51,20.96 U10.5
  Top Layer w0.381: U10.5 v1(62.65,21.84)
  Bottom Layer w0.381: v1(62.65,21.84) 63.5,21.84 66.04,19.31 U54.1
HRTIME_CHD2(PB15): length 13.6
  Top Layer w0.254: U14.28 51.69,17.95 51.69,16.76 52.07,16.38 52.96,16.38 56,19.42 R45.2 62.51,19.42 U10.6
RED(PB5): length 28.8
  Top Layer w0.254: LED3.1 v1(33.4,13.68) ; v1(48.01,13.97) 47.51,14.47 U14.41
  VCC w0.254: v1(48.01,13.97) 46.48,15.49 43.05,15.49 42.42,16.13 35.18,16.13 33.4,14.35 v1(33.4,13.68)
SW1: length 18.1
  Top Layer w0.381: v1(28.19,17.27) 28.83,16.63 C31.1 32.75,16.63 U11.4
  GND w0.381: v1(28.19,17.27) 28.19,22.61 30.73,25.15 33.15,25.15 v3(34.42,26.42)
  vias: v3(34.61,33.16) v3(34.61,32.01) v3(35.92,33.16) v3(35.92,32.01) v3(35.87,29.61) v3(35.87,28.47) v3(35.87,27.3) v3(37.18,29.61) v3(37.18,28.47) v3(37.18,27.3) v3(38.48,29.61) v3(38.48,28.47) v3(38.48,27.3) v3(41.92,37.68) v3(41.92,36.54) v3(41.92,35.37) v3(41.92,33.46) v3(41.92,32.32) v3(41.92,31.15) v3(41.93,28.93) v3(41.93,27.78) v3(41.93,26.61) v3(43.23,37.68) v3(43.23,36.54) v3(43.23,35.37) v3(43.22,33.46) v3(43.22,32.32) v3(43.22,31.15) v3(43.24,28.93) v3(43.24,27.78) v3(43.24,26.61) v3(44.53,37.68) v3(44.53,36.54) v3(44.53,35.37) v3(44.53,33.46) v3(44.53,32.32) v3(44.53,31.15) v3(44.54,28.93) v3(44.54,27.78) v3(44.54,26.61)
SW2: length 19
  Top Layer w0.381: v1(72.52,20.7) 73.43,20.7 C29.1 v1(73.49,27.94) ; 68.05,20.83 v1(69.21,20.83)
  Bottom Layer w0.381: v1(69.21,20.83) 69.85,20.19 72.01,20.19 v1(72.52,20.7) ; v1(68.33,29.34) 72.09,29.34 v1(73.49,27.94)
  vias: v3(58.22,37.74) v3(58.22,36.6) v3(58.22,35.43) v3(58.21,33.52) v3(58.21,32.38) v3(58.21,31.21) v3(58.23,28.99) v3(58.23,27.85) v3(58.23,26.67) v3(59.52,37.74) v3(59.52,36.6) v3(59.52,35.43) v3(59.52,33.52) v3(59.52,32.38) v3(59.52,31.21) v3(59.53,28.99) v3(59.53,27.85) v3(59.53,26.67) v3(60.83,37.74) v3(60.83,36.6) v3(60.83,35.43) v3(60.82,33.52) v3(60.82,32.38) v3(60.82,31.21) v3(60.84,28.99) v3(60.84,27.85) v3(60.84,26.67) v3(64.3,29.45) v3(64.3,28.31) v3(64.3,27.13) v3(65.61,29.45) v3(65.61,28.31) v3(65.61,27.13) v3(66.91,29.45) v3(66.91,28.31) v3(66.91,27.13)
SWCLK(PA14): length 31.5
  Top Layer w0.254: U14.37 44.53,16.47 36.96,8.89 24.18,8.89 22.74,7.45 22.74,4.83
  Bottom Layer w0.254: v1(22.74,4.83) 23.5,4.83 23.76,4.56 R40.1
SWDIO(PA13): length 38
  Top Layer w0.254: v1(21.34,4.83) 21.24,4.93 21.24,7.78 22.86,9.4 36.7,9.4 43.43,16.13 v1(43.43,16.26) ; v1(48.67,19.3) U14.34
  GND w0.254: v1(43.43,16.26) 46.48,19.3 v1(48.67,19.3)
  Bottom Layer w0.254: R41.1 21.97,3.95 21.97,4.57 21.72,4.83 v1(21.34,4.83)
TG1_H: length 7.1
  Top Layer w0.254: R23.2 30.99,23.12 30.99,18.59 31.76,17.81 U11.3
TG2_H: length 6
  Top Layer w0.254: 68.05,19.56 70.87,19.56 71.76,20.45 R24.1
USART2_RX(PB4): length 18.7
  Top Layer w0.254: CN2.2 33.01,7.33 33.56,7.87 37.46,7.87 44.56,14.97 U14.40
USART2_TX(PB3): length 20.2
  Top Layer w0.254: CN2.3 31.76,7.33 32.82,8.38 37.21,8.38 44.32,15.49 46.14,15.49 U14.39
VCAP: length 28.8
  Top Layer w0.254: R10.1 83.63,28.26 87.88,32.51 87.88,35.52 90.55,38.19
  Bottom Layer w0.381: R78.1 v1(86.11,35.46) 85.63,35.46 84.65,34.49 U58.3
  vias: v1(86.11,41.02) v1(86.11,39.17) v1(86.11,37.32) v1(86.13,33.91) v1(87.57,41.02) v1(87.57,39.17) v1(87.57,37.32) v1(87.57,35.46) v1(87.59,33.91) v1(89.03,41.02) v1(89.03,39.17) v1(89.03,37.32) v1(89.03,35.46) v1(90.3,41.02) v1(91.76,41.02)
VCAP+T: length 6.2
  Bottom Layer w0.381: U58.2 84,34.54 83.08,35.46 80.99,35.46
  vias: v3(64.38,39.2) v3(64.38,38.06) v3(64.38,36.89) v3(65.68,39.2) v3(65.68,38.06) v3(65.68,36.89) v3(66.99,39.2) v3(66.99,38.06) v3(66.99,36.89) v3(70.64,39.6) v3(70.64,38.3) v3(70.64,37) v3(71.79,39.6) v3(71.79,38.3) v3(71.79,37) v3(73.38,39.72) v3(73.38,38.41) v3(73.38,37.11) v3(74.52,39.72) v3(74.52,38.41) v3(74.52,37.11) v3(75.78,41.45) v3(75.78,40.15) v3(75.78,38.85) v3(75.82,37.41) v3(75.82,36.1) v3(75.82,34.8) v3(76.93,41.45) v3(76.93,40.15) v3(76.93,38.85) v3(76.96,37.41) v3(76.96,36.1) v3(76.96,34.8) v3(80.58,41.48) v3(80.58,40.17) v3(80.58,38.87) v3(80.58,37.42) v3(80.58,36.12) v3(80.58,34.81) v3(81.72,41.48) v3(81.72,40.17) v3(81.72,38.87) v3(81.72,37.42) v3(81.72,36.12) v3(81.72,34.81)
$1N328: length 3.5
  Top Layer w0.381: R1.2 4.93,32.81 8.22,32.81 U7.1
$1N1423: length 5.3
  Top Layer w0.254: Q10.1 67.67,24.94 69.42,24.94 70.11,24.25 R25.2
  Top Layer w0.508: Q10.1 67.54,22.89 R4.2
$1N1424: length 13.2
  Top Layer w0.254: R24.2 71.76,29.59 68.71,32.64 67.64,32.64 R3.2
  Top Layer w0.508: R3.2 67.51,34.42 67.54,34.45
$1N1425: length 15.7
  Top Layer w0.254: R23.1 v1(31.24,26.54) ; R2.2 v3(39.88,32.51)
  Top Layer w0.508: Q7.1 39.01,32.54 R2.2
  VCC w0.254: v3(39.88,32.51) 37.95,32.51 31.98,26.54 v1(31.24,26.54)
$1N1426: length 5.9
  Top Layer w0.381: 39.01,24.94 39.08,25.02 39.88,25.02 40.76,24.14 40.76,22.46
  Top Layer w0.508: 39.01,24.94 39.01,22.89 R21.2
$1N12542: length 2.1
  Top Layer w0.254: R76.1 17.96,28.06 U55.8
$1N12839: length 1.7
  Bottom Layer w0.254: U56.8 22.36,21.22 R75.1
$1N14388: length 18.7
  Top Layer w0.381: U7.5 13.75,31.85 v1(14.73,30.86)
  Bottom Layer w0.254: 9.14,30.35 9.14,29.53 Q12.1 ; 9.14,30.35 14.22,30.35 v1(14.73,30.86) ; 9.14,30.35 2.98,30.35 Q5.1
$1N14671: length 2.4
  Bottom Layer w0.381: 83.35,25.9 83.35,23.77 R79.1
$2N2913: length 5.9
  Top Layer w0.381: 68.05,18.29 68.17,18.16 70.36,18.16 71.44,19.24 C29.2
$2N2920: length 4
  Top Layer w0.381: U11.2 32.81,19.05 v1(31.75,19.05) ; C31.2 v1(29.69,18.8)
  Bottom Layer w0.381: v1(31.75,19.05) 29.94,19.05 v1(29.69,18.8)
$2N2938: length 5.5
  Top Layer w0.254: U14.6 50.15,9.45 50.15,7.88 49.93,7.67 X1.1 51.8,6.34 C20.1
$2N2946: length 3.2
  Top Layer w0.254: R33.2 44.27,12.97 U14.44
$2N2947: length 1.6
  Top Layer w0.254: R34.2 21.93,10.29 LED1.2
$2N2950: length 1.6
  Top Layer w0.254: LED2.2 21.92,11.99 R35.2
$2N2953: length 1.6
  Top Layer w0.254: R36.2 21.92,13.69 LED3.2
$2N2956: length 1.6
  Top Layer w0.254: LED4.2 21.91,15.38 R37.2
$2N3017: length 9.3
  Top Layer w0.254: X1.3 47.36,4.59 46.61,5.33 45.98,5.33 C19.1 45.85,7.24 46.23,7.62 48.75,7.62 49.67,8.54 U14.5
$2N3018: length 16.9
  Top Layer w0.254: U14.7 50.67,8.16 51.21,7.62 52.58,7.62 54.04,6.16 SW2.1 54.64,3.43 58.42,3.43 59.02,4.03 SW2.2 61.06,4.03 C18.2 62.68,4 R32.1
$2N8090: length 3.9
  Top Layer w0.254: 82.04,14.04 82.04,16.32 R12.2 R10.2
$2N8093: length 5.6
  Top Layer w0.254: 83.31,14.04 83.31,14.61 84.33,15.62 84.84,15.62 85.19,15.98 R11.2 85.25,16.35 R13.1
$2N8094: length 5.2
  Top Layer w0.254: 84.58,14.04 85.28,14.04 86.74,15.49 86.74,16.33 R13.2 R14.1
$2N12308: length 5.3
  Top Layer w0.381: 80.77,14.04 80.77,14.99 79.69,16.07 79.69,16.3 ; C26.1 79.52,16.47 79.69,16.3 ; 79.69,16.3 79.69,16.69
$2N12545: length 4
  Top Layer w0.254: R71.2 R72.2 79.5,6.34 79.5,8.57
$2N12555: length 6.2
  Top Layer w0.254: R26.1 74.7,4.71 R73.2 76.21,6.74 76.58,7.11 77.98,7.11 78.23,7.37 78.23,8.57
$2N12559: length 4.9
  Top Layer w0.254: 76.96,8.57 74.62,6.23 R26.2 R74.1
$2N20212:
  vias: v1(7.11,8.25) v1(7.11,7.62) v1(7.75,8.25) v1(7.75,7.62) v1(10.42,8.06) v1(10.42,7.27) v3(10.92,15.75) v3(10.92,14.61) v3(10.92,13.43) v3(12.57,16) v3(12.57,14.86) v3(12.57,13.69)
$2N20919:
  vias: v1(14.48,6.86) v1(15.24,6.86) v1(15.24,6.06) v3(12.19,5.21) v3(12.19,4.06) v3(12.19,2.89)
$2N20924: length 2
  Bottom Layer w0.254: U60.6 14.29,1.36 C54.2

## Copper pours and planes (outline as drawn; the poured copper is in the pictures)
+3.3V on Bottom Layer: 28.56,11.68 30.48,11.68 30.48,7.75 28.56,7.75
+3.3VO on Top Layer: 15.75,6.6 15.75,1.78 20.17,1.78 20.41,2.02 20.41,6.6
+3.3VO on Bottom Layer: 18.03,7.49 25.78,7.49 25.78,4.94 18.03,4.94
+3.3VO on Bottom Layer: 25.48,7.51 26.67,8.7 26.67,13.21 28.26,13.21 28.26,7.43 25.78,4.95 25.48,5.25
+3.3VO on Bottom Layer: 16.85,4.52 18.03,4.52 18.03,6.6 20.45,6.6 20.45,1.73 16.85,1.73
+12V on Top Layer: 14.61,17.14 14.61,12.95 15.56,12 15.56,6.96 18.03,6.96 18.03,16.13 17.02,17.14
+12V on Bottom Layer: 15.31,10.75 15.31,8.04 15.84,7.51 15.84,4.95 17.64,4.95 17.64,10.75
AGND on Top Layer: 23.44,1.27 90.13,1.27 90.13,13.97 23.44,13.97
AGND on Top Layer: 74.42,22.1 90.17,22.1 90.17,12.45 74.42,12.45
AGND on Top Layer: 42.8,22.1 59.23,22.1 59.23,12.32 42.8,12.32
AGND on Bottom Layer: 36.26,1.27 90.13,1.27 90.13,12.57 36.26,12.57
AGND on Bottom Layer: 74.42,21.59 89.92,21.59 89.92,12.45 74.42,12.45
AGND on Bottom Layer: 42.8,22.1 59.23,22.1 59.23,12.32 42.8,12.32
AGND on Bottom Layer: 31.31,6.8 36.37,6.8 36.37,1.27 31.31,1.27
GND on Top Layer: -2.03,49.91 98.3,49.91 98.3,-2.54 -2.03,-2.54
GND on Bottom Layer: -0.89,49.4 96.65,49.4 96.65,-1.65 -0.89,-1.65
GND on GND: 0.13,48.39 93.81,48.39 93.81,-3.43 0.13,-3.43
GND on VCC: -1.02,49.66 94.87,49.66 94.87,-1.4 -1.02,-1.4
VBAT+ on Top Layer: 0.13,22.23 14.08,22.23 14.08,17.62 0.13,17.62
VBAT+ on Top Layer: 6.73,5.97 6.73,7.11 6.35,7.49 6.35,9 7.11,9 7.11,17.62 4.7,17.62 4.7,11.18 5.46,10.41 5.46,5.97
VBAT+ on Bottom Layer: 0.13,22.23 14.08,22.23 14.08,17.62 0.13,17.62
VBAT+T on Top Layer: 1.52,30.07 14.19,30.07 14.19,25.5 1.52,25.5
VBAT+T on Bottom Layer: 1.52,29.95 14.19,29.95 14.19,25.5 1.52,25.5
VCC on Bottom Layer: 30.73,11.69 35.86,11.69 35.86,7.17 30.73,7.17
VCC on VCC: 17.84,15.79 81.15,15.79 81.15,2.41 17.84,2.41
VCC on VCC: 6.8,29.06 81.42,29.06 81.42,6.67 6.8,6.67
VCC on VCC: 6.67,29.02 81.29,29.02 81.29,6.64 6.67,6.64
VCC on VCC: 75.95,22.1 81.15,22.1 81.15,15.49 75.95,15.49
VIN+ on Top Layer: 2.54,41.91 8.43,41.91 9.33,42.81 9.33,45.39 13.21,45.39 13.21,34.8 2.54,34.8
VIN+ on Bottom Layer: 1.81,30.68 14.13,30.68 14.13,41.78 1.81,41.78
VIN+T on Top Layer: 16.64,45.34 16.64,35.05 18.29,33.4 28.07,33.4 30.3,35.63 34.49,35.63 34.67,35.81 40.26,35.81 40.26,41.4 29.78,41.4 27.11,44.07 23.5,44.07 22.23,45.34
VIN+T on Bottom Layer: 16.64,45.34 16.64,35.05 18.29,33.4 28.07,33.4 30.3,35.63 34.49,35.63 34.67,35.81 40.26,35.81 40.26,41.4 29.78,41.4 27.11,44.07 23.5,44.07 22.23,45.34
SW1 on Top Layer: 39.12,26.03 39.88,26.03 41.02,24.89 45.47,24.89 45.47,40.77 40.77,40.77 40.77,32.13 40.01,31.37 39.12,31.37
SW1 on Top Layer: 38.23,35.31 38.23,31.37 40.01,31.37 40.01,25.92 33.78,25.92 33.78,35.31
SW1 on Bottom Layer: 38.23,35.31 38.23,31.37 40.01,31.37 40.01,25.92 33.78,25.92 33.78,35.31
SW1 on Bottom Layer: 39.12,26.03 39.88,26.03 41.02,24.89 45.47,24.89 45.47,40.77 40.77,40.77 40.77,32.13 40.01,31.37 39.12,31.37
SW2 on Top Layer: 57.13,40.87 62.36,40.87 62.36,35.25 66.78,35.25 66.78,31.37 68.71,31.37 68.71,25.65 57.13,25.65
SW2 on Bottom Layer: 57.13,40.87 62.36,40.87 62.36,35.25 66.78,35.25 66.78,31.37 68.71,31.37 68.71,25.65 57.13,25.65
VCAP on Top Layer: 85.73,42.42 85.73,33.05 88.52,33.05 88.52,33.88 90.76,36.12 92.58,36.12 92.58,42.42 85.73,42.42
VCAP on Bottom Layer: 85.73,42.42 85.73,33.05 88.52,33.05 88.52,33.88 90.76,36.12 92.58,36.12 92.58,42.42 85.73,42.42
VCAP+T on Top Layer: 62.74,35.69 73.15,35.69 75.95,32.89 82.56,32.89 82.56,42.48 75.69,42.48 74.87,41.66 62.74,41.66
VCAP+T on Bottom Layer: 62.74,35.69 73.15,35.69 75.95,32.89 82.56,32.89 82.56,42.48 75.69,42.48 74.87,41.66 62.74,41.66
$2N20212 on Top Layer: 13.59,17.14 13.59,12.57 11.56,12.57 10.51,11.52 10.51,17.02 10.63,17.14
$2N20212 on Top Layer: 6.86,5.72 7.87,5.72 7.87,8.56 6.86,8.56
$2N20212 on Top Layer: 9.7,5.98 11.34,5.98 11.34,7.87 10.58,8.64 9.7,8.64
$2N20212 on Bottom Layer: 7.96,7.24 9.28,7.24 9.71,6.81 9.71,5.98 11.32,5.98 11.32,7.86 10.54,8.64 7.87,8.64 7.87,7.33
$2N20212 on Bottom Layer: 6.73,7.24 8.07,7.24 8.07,9.09 11.56,12.57 13.59,12.57 13.59,17.14 10.67,17.14 6.73,13.21
$2N20262 on Top Layer: 11.12,5.47 11.12,4.14 10.54,3.56 7.87,3.56 7.87,4.95 9.06,4.95 9.58,5.47
$2N20919 on Top Layer: 14.61,1.78 14.61,6.86 11.68,6.86 11.68,1.78
$2N20919 on Bottom Layer: 11.56,5.84 11.56,0.64 13.52,0.64 13.52,5.84
$2N20919 on Bottom Layer: 14.73,4.95 14.73,6.22 13.97,6.98 13.97,7.93 15.18,7.93 15.62,7.49 15.62,4.95
$2N20919 on VCC: 11.68,1.78 15.88,1.78 15.88,7.49 11.68,7.49

## Text on the board
Bottom Silkscreen Layer: +3.3 | 单点接地 | 输入电流采样
Top Silkscreen Layer: VERSION1.1 | BOOT0 | V | G | HRTIME_CHA1 | CHA1 | CHA2 | CHD1 | CHD2 | TG2_H | DIO | CLK | GND | VCC | USART2_TX | USART2_RX | CAN_H | CAN_L | TG1_H | BG1_L | BG2_L | +12 | BLUE | GREEN | RED | NRST | HRTIME_CHD1 | 底盘输出 | 裁判系统输入 | 电容模组
